# Altium project WatchDog.PrjPCB
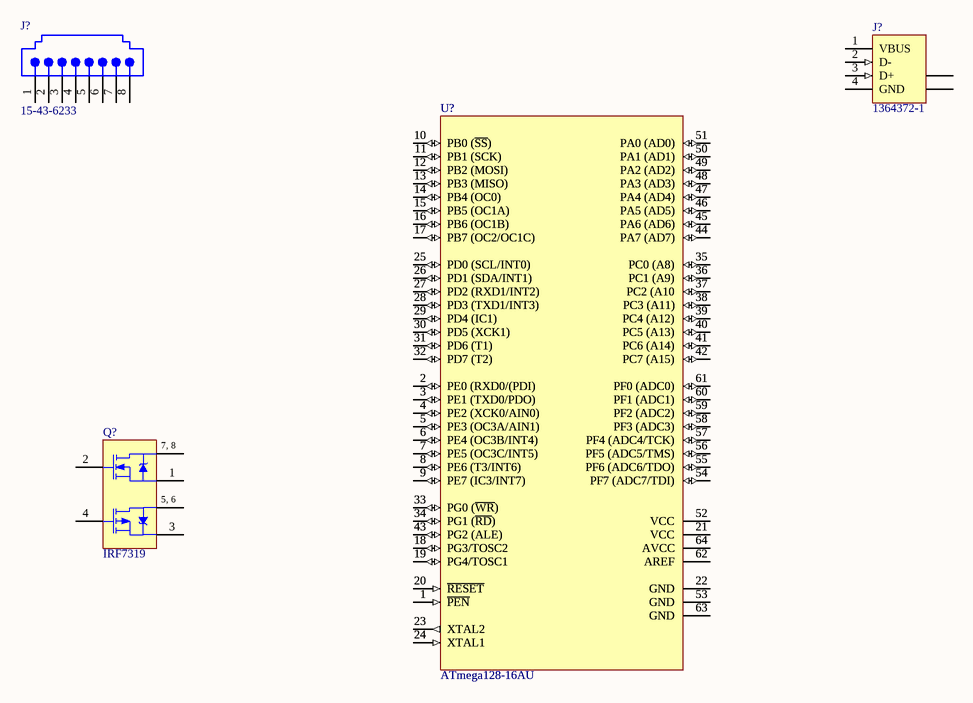
[diagram p0: WatchDogPCB.SchDoc]
1 sheet, 5 parts. Net scope: global (net labels, ports and power ports of the same name join across sheets).

## Sheet WatchDogPCB.SchDoc
size A4

### Parts
(Parts that share a designator on the sheet are numbered #1, #2 ... from top to bottom, then left to right.)
J?#1  1364372-1  [1364372]
J?#2  15-43-6233  [15-43-6233]
Q?  IRF7319  [SO-8_N]
U?#1  ATmega128-16AU  [64A_N]
U?#2  ATmega128-16AU  [64A_N]

### Nets
NetQ?_5: Q?.5(D2) Q?.6(D2)
NetQ?_7: Q?.7(D1) Q?.8(D1)
NetU?#1_1: U?#1.1(~{PEN}) U?#2.1(~{PEN})
NetU?#1_2: U?#1.2(PE0_(RXD0/(PDI)) U?#2.2(PE0_(RXD0/(PDI))
NetU?#1_3: U?#1.3(PE1_(TXD0/PDO)) U?#2.3(PE1_(TXD0/PDO))
NetU?#1_4: U?#1.4(PE2_(XCK0/AIN0)) U?#2.4(PE2_(XCK0/AIN0))
NetU?#1_5: U?#1.5(PE3_(OC3A/AIN1)) U?#2.5(PE3_(OC3A/AIN1))
NetU?#1_6: U?#1.6(PE4_(OC3B/INT4)) U?#2.6(PE4_(OC3B/INT4))
NetU?#1_7: U?#1.7(PE5_(OC3C/INT5)) U?#2.7(PE5_(OC3C/INT5))
NetU?#1_8: U?#1.8(PE6_(T3/INT6)) U?#2.8(PE6_(T3/INT6))
NetU?#1_9: U?#1.9(PE7_(IC3/INT7)) U?#2.9(PE7_(IC3/INT7))
NetU?#1_10: U?#1.10(PB0_(~{SS})) U?#2.10(PB0_(~{SS}))
NetU?#1_11: U?#1.11(PB1_(SCK)) U?#2.11(PB1_(SCK))
NetU?#1_12: U?#1.12(PB2_(MOSI)) U?#2.12(PB2_(MOSI))
NetU?#1_13: U?#1.13(PB3_(MISO)) U?#2.13(PB3_(MISO))
NetU?#1_14: U?#1.14(PB4_(OC0)) U?#2.14(PB4_(OC0))
NetU?#1_15: U?#1.15(PB5_(OC1A)) U?#2.15(PB5_(OC1A))
NetU?#1_16: U?#1.16(PB6_(OC1B)) U?#2.16(PB6_(OC1B))
NetU?#1_17: U?#1.17(PB7_(OC2/OC1C)) U?#2.17(PB7_(OC2/OC1C))
NetU?#1_18: U?#1.18(PG3/TOSC2) U?#2.18(PG3/TOSC2)
NetU?#1_19: U?#1.19(PG4/TOSC1) U?#2.19(PG4/TOSC1)
NetU?#1_20: U?#1.20(~{RESET}) U?#2.20(~{RESET})
NetU?#1_21: U?#1.21(VCC) U?#2.21(VCC)
NetU?#1_22: U?#1.22(GND) U?#2.22(GND)
NetU?#1_23: U?#1.23(XTAL2) U?#2.23(XTAL2)
NetU?#1_24: U?#1.24(XTAL1) U?#2.24(XTAL1)
NetU?#1_25: U?#1.25(PD0_(SCL/INT0)) U?#2.25(PD0_(SCL/INT0))
NetU?#1_26: U?#1.26(PD1_(SDA/INT1)) U?#2.26(PD1_(SDA/INT1))
NetU?#1_27: U?#1.27(PD2_(RXD1/INT2)) U?#2.27(PD2_(RXD1/INT2))
NetU?#1_28: U?#1.28(PD3_(TXD1/INT3)) U?#2.28(PD3_(TXD1/INT3))
NetU?#1_29: U?#1.29(PD4_(IC1)) U?#2.29(PD4_(IC1))
NetU?#1_30: U?#1.30(PD5_(XCK1)) U?#2.30(PD5_(XCK1))
NetU?#1_31: U?#1.31(PD6_(T1)) U?#2.31(PD6_(T1))
NetU?#1_32: U?#1.32(PD7_(T2)) U?#2.32(PD7_(T2))
NetU?#1_33: U?#1.33(PG0_(~{WR})) U?#2.33(PG0_(~{WR}))
NetU?#1_34: U?#1.34(PG1_(~{RD})) U?#2.34(PG1_(~{RD}))
NetU?#1_35: U?#1.35(PC0_(A8)) U?#2.35(PC0_(A8))
NetU?#1_36: U?#1.36(PC1_(A9)) U?#2.36(PC1_(A9))
NetU?#1_37: U?#1.37(PC2_(A10) U?#2.37(PC2_(A10)
NetU?#1_38: U?#1.38(PC3_(A11)) U?#2.38(PC3_(A11))
NetU?#1_39: U?#1.39(PC4_(A12)) U?#2.39(PC4_(A12))
NetU?#1_40: U?#1.40(PC5_(A13)) U?#2.40(PC5_(A13))
NetU?#1_41: U?#1.41(PC6_(A14)) U?#2.41(PC6_(A14))
NetU?#1_42: U?#1.42(PC7_(A15)) U?#2.42(PC7_(A15))
NetU?#1_43: U?#1.43(PG2_(ALE)) U?#2.43(PG2_(ALE))
NetU?#1_44: U?#1.44(PA7_(AD7)) U?#2.44(PA7_(AD7))
NetU?#1_45: U?#1.45(PA6_(AD6)) U?#2.45(PA6_(AD6))
NetU?#1_46: U?#1.46(PA5_(AD5)) U?#2.46(PA5_(AD5))
NetU?#1_47: U?#1.47(PA4_(AD4)) U?#2.47(PA4_(AD4))
NetU?#1_48: U?#1.48(PA3_(AD3)) U?#2.48(PA3_(AD3))
NetU?#1_49: U?#1.49(PA2_(AD2)) U?#2.49(PA2_(AD2))
NetU?#1_50: U?#1.50(PA1_(AD1)) U?#2.50(PA1_(AD1))
NetU?#1_51: U?#1.51(PA0_(AD0)) U?#2.51(PA0_(AD0))
NetU?#1_52: U?#1.52(VCC) U?#2.52(VCC)
NetU?#1_53: U?#1.53(GND) U?#2.53(GND)
NetU?#1_54: U?#1.54(PF7_(ADC7/TDI)) U?#2.54(PF7_(ADC7/TDI))
NetU?#1_55: U?#1.55(PF6_(ADC6/TDO)) U?#2.55(PF6_(ADC6/TDO))
NetU?#1_56: U?#1.56(PF5_(ADC5/TMS)) U?#2.56(PF5_(ADC5/TMS))
NetU?#1_57: U?#1.57(PF4_(ADC4/TCK)) U?#2.57(PF4_(ADC4/TCK))
NetU?#1_58: U?#1.58(PF3_(ADC3)) U?#2.58(PF3_(ADC3))
NetU?#1_59: U?#1.59(PF2_(ADC2)) U?#2.59(PF2_(ADC2))
NetU?#1_60: U?#1.60(PF1_(ADC1)) U?#2.60(PF1_(ADC1))
NetU?#1_61: U?#1.61(PF0_(ADC0)) U?#2.61(PF0_(ADC0))
NetU?#1_62: U?#1.62(AREF) U?#2.62(AREF)
NetU?#1_63: U?#1.63(GND) U?#2.63(GND)
NetU?#1_64: U?#1.64(AVCC) U?#2.64(AVCC)

Not connected (* = marked no-connect by the designer): J?#1 1(VBUS) 2(D-) 3(D+) 4(GND) 5(SHLD) 6(SHLD); J?#2 1 2 3 4 5 6 7 8; Q? 1(S1) 2(G1) 3(S2) 4(G2)

### Notes on the sheet
- (in symbol IRF7319) 7, 8; 5, 6

### Library data of the parts
J?#1 = 1364372-1: USB 1.1, Right Angle, Thru-Hole, A Type, Receptacle, 4 Position, Black; ContactMaterial: Copper Alloy; ContactPlating: Gold (30) over Palladium Nickel; TerminationLength: 2.84mm [0.112in.]; PCB_Layout: Complies with manufacturer's recommendation.; DrillSize: Corresponds to nominal value.; PanelGround: Without; Published: 15-Jul-2004; DatasheetDocument: 11-Jan-2004; PackageDocument: 11-Jan-2004; PackageReference: 1364372; Publisher: Altium Limited; HousingMaterial: Thermoplastic; ComponentLink1Description: Manufacturer Link; ComponentLink1URL: http://www.tycoelectronics.com/; ComponentLink2Description: Packaging Specification; ComponentLink2URL: http://ecommas.tycoelectronics.com/commerce/DocumentDelivery/DDEController?Action=showdoc&DocId=Customer+Drawing%7F1364372%7FD%7Ftif%7FEnglish%7FENG_CD_1364372_D.tif
J?#2 = 15-43-6233: Right Angle, Standard Profile, RJ45-Keyed, Flange Mount PCB Jack; Ports: 1; Positions/Loaded: Port1 - 8 Keyed/8; PerformanceCategory: 3; PCB_Mounting: Thru-Hole; ComponentAvailability: Obsolete; DrillSize: Nominal, Rounded to nearest 0.05mm; PCB_Layout: Complies with Manufacturer's Recommendation.; Published: 25-Jun-2002; DatasheetDocument: 18-Dec-2001; PackageDocument: 18-Dec-2001; PackageReference: 15-43-6233; Publisher: Altium Limited; ComponentLink1Description: Manufacturer Link; ComponentLink1URL: http://www.molex.com/; ComponentLink2Description: Datasheet; ComponentLink2URL: http://www.molex.com/cmc_upload/common_files/1212003_catalogmx41314.pdf; ComponentLink3Description: Iges Model; ComponentLink3URL: http://www.molex.com/pdm_docs/igs/15-43-6233_igs.zip
Q? = IRF7319: HEXFET Power MOSFET; Published: 8-Jun-2000; LatestRevisionDate: 13-Apr-2006; LatestRevisionNote: IPC-7351 Footprint Added.; DatasheetVersion: Sep-1997; PackageVersion: Feb-2001; PackageReference: SO-8; Publisher: Altium Limited; PackageDescription: 8-Pin Plastic Small Outline Integrated Circuit 1.27 mm Pitch; Code_JEDEC: MS-012-AA; Code_IPC: SOIC127P600-8; ComponentLink1Description: Manufacturer Link; ComponentLink1URL: http://www.irf.com/; ComponentLink2Description: Datasheet; ComponentLink2URL: http://www.irf.com/product-info/datasheets/data/IRFN140.pdf
U?#1 U?#2 = ATmega128-16AU: 8-bit AVR Microcontroller, 4.5-5.5V, 128KB Flash, 4KB EEPROM, 4KB SRAM, 64-pin TQFP, Industrial Grade (-40°C to 85°C), Pb-Free; Published: 1-Apr-2010; DatasheetVersion: revS, Jul-2009; PackageVersion: revB, Oct-2001; PackageReference: 64A; Publisher: Altium Limited; PackageDescription: 64-Pin Plastic Thin Profile Quad Flat Pack, 14 x 14 x 1.0 mm Body, 0.8 mm Pitch (TQFP); Supplier 1: Digi-Key; Supplier Part Number 1: ATMEGA128-16AU-ND; Supplier 2: Farnell; Supplier Part Number 2: 9171118; Supplier 3: Farnell; Supplier Part Number 3: 1661737; Supplier 4: Mouser; Supplier Part Number 4: 556-ATMEGA128-16AU; Code_JEDEC: MS-026-AEB; ComponentLink1Description: Manufacturer Link; ComponentLink1URL: http://www.atmel.com/products/avr/default.asp?; ComponentLink2Description: ATmega128(L) Datasheet; ComponentLink2URL: http://www.atmel.com/dyn/resources/prod_documents/doc2467.pdf; ComponentLink3Description: ATmega128(L) Summary; ComponentLink3URL: http://www.atmel.com/dyn/resources/prod_documents/2467S.pdf; ComponentLink4Description: Atmel.com Home; ComponentLink4URL: http://www.atmel.com